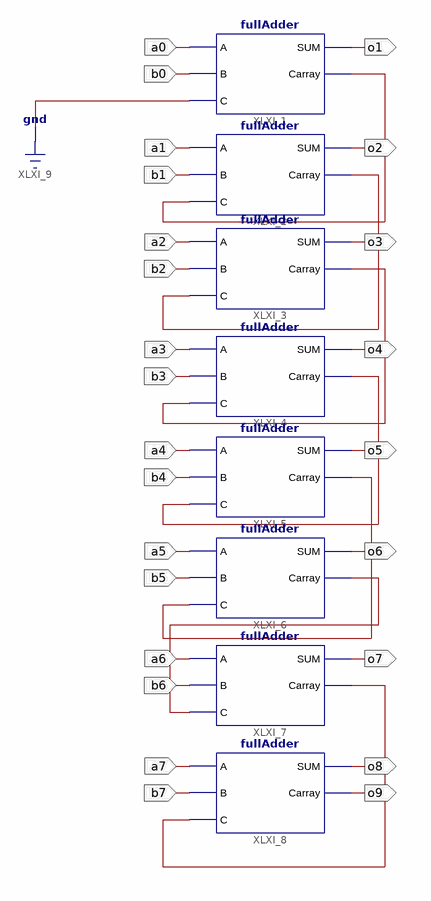
[diagram p0: schematic sheet 1]
// Xilinx ISE schematic Sum.sch (spartan6) as structural Verilog: 8 symbols, 25 ports
module Sum (
  input  a0,
  input  b0,
  input  a1,
  input  b1,
  input  a2,
  input  b2,
  input  a3,
  input  b3,
  input  a4,
  input  b4,
  input  a5,
  input  b5,
  input  a6,
  input  b6,
  input  a7,
  input  b7,
  output o1,
  output o2,
  output o4,
  output o5,
  output o6,
  output o7,
  output o8,
  output o3,
  output o9
);

  wire XLXN_1, XLXN_2, XLXN_3, XLXN_4, XLXN_5, XLXN_6, XLXN_14;

  fullAdder XLXI_1 (.A(a0), .B(b0), .C(1'b0), .Carray(XLXN_1), .SUM(o1));
  fullAdder XLXI_2 (.A(a1), .B(b1), .C(XLXN_1), .Carray(XLXN_14), .SUM(o2));
  fullAdder XLXI_3 (.A(a2), .B(b2), .C(XLXN_14), .Carray(XLXN_2), .SUM(o3));
  fullAdder XLXI_4 (.A(a3), .B(b3), .C(XLXN_2), .Carray(XLXN_3), .SUM(o4));
  fullAdder XLXI_5 (.A(a4), .B(b4), .C(XLXN_3), .Carray(XLXN_4), .SUM(o5));
  fullAdder XLXI_6 (.A(a5), .B(b5), .C(XLXN_4), .Carray(XLXN_5), .SUM(o6));
  fullAdder XLXI_7 (.A(a6), .B(b6), .C(XLXN_5), .Carray(XLXN_6), .SUM(o7));
  fullAdder XLXI_8 (.A(a7), .B(b7), .C(XLXN_6), .Carray(o9), .SUM(o8));
endmodule
